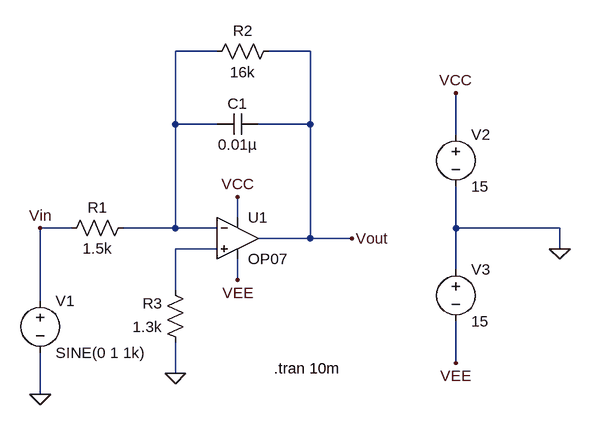
[diagram p0: schematic Integrator.asc]
Integrator.asc, the LTspice schematic file:
Version 4.1
SHEET 1 880 680
WIRE 160 -128 96 -128
WIRE 304 -128 240 -128
WIRE 96 -16 96 -128
WIRE 160 -16 96 -16
WIRE 304 -16 304 -128
WIRE 304 -16 224 -16
WIRE 528 0 528 -64
WIRE 192 128 192 96
WIRE -64 144 -112 144
WIRE 96 144 96 -16
WIRE 96 144 16 144
WIRE 160 144 96 144
WIRE 528 144 528 80
WIRE 688 144 528 144
WIRE 304 160 304 -16
WIRE 304 160 224 160
WIRE 368 160 304 160
WIRE 160 176 96 176
WIRE 688 176 688 144
WIRE 528 208 528 144
WIRE 192 224 192 192
WIRE 96 240 96 176
WIRE -112 256 -112 144
WIRE 528 352 528 288
WIRE 96 368 96 320
WIRE -112 400 -112 336
FLAG -112 400 0
FLAG 96 368 0
FLAG 688 176 0
FLAG 192 224 VEE
FLAG 528 352 VEE
FLAG 192 96 VCC
FLAG 528 -64 VCC
FLAG 368 160 Vout
FLAG -112 144 Vin
SYMBOL OpAmps\\OP07 192 96 R0
SYMATTR InstName U1
SYMBOL res 32 128 R90
WINDOW 0 0 56 VBottom 2
WINDOW 3 32 56 VTop 2
SYMATTR InstName R1
SYMATTR Value 1.5k
SYMBOL res 256 -144 R90
WINDOW 0 0 56 VBottom 2
WINDOW 3 32 56 VTop 2
SYMATTR InstName R2
SYMATTR Value 16k
SYMBOL res 112 336 R180
WINDOW 0 36 76 Left 2
WINDOW 3 36 40 Left 2
SYMATTR InstName R3
SYMATTR Value 1.3k
SYMBOL voltage -112 240 R0
WINDOW 123 0 0 Left 0
WINDOW 39 0 0 Left 0
SYMATTR InstName V1
SYMATTR Value SINE(0 1 1k)
SYMBOL voltage 528 -16 R0
WINDOW 123 0 0 Left 0
WINDOW 39 0 0 Left 0
SYMATTR InstName V2
SYMATTR Value 15
SYMBOL voltage 528 192 R0
WINDOW 123 0 0 Left 0
WINDOW 39 0 0 Left 0
SYMATTR InstName V3
SYMATTR Value 15
SYMBOL cap 224 -32 R90
WINDOW 0 0 32 VBottom 2
WINDOW 3 32 32 VTop 2
SYMATTR InstName C1
SYMATTR Value 0.01µ
TEXT 248 360 Left 2 !.tran 10m

The netlist it stands for:
* Integrator.asc
X§U1 N002 N001 VCC VEE Vout LT1001  ; OP07, pins In+ In- V+ V- OUT
R1 N001 Vin 1.5k
R2 Vout N001 16k
R3 0 N002 1.3k
V1 Vin 0 SINE(0 1 1k)
V2 VCC 0 15
V3 0 VEE 15
C1 Vout N001 0.01µ
.tran 10m
.lib LTC.lib
.backanno
.end